# EAGLE design mmc (EAGLE 5.03)
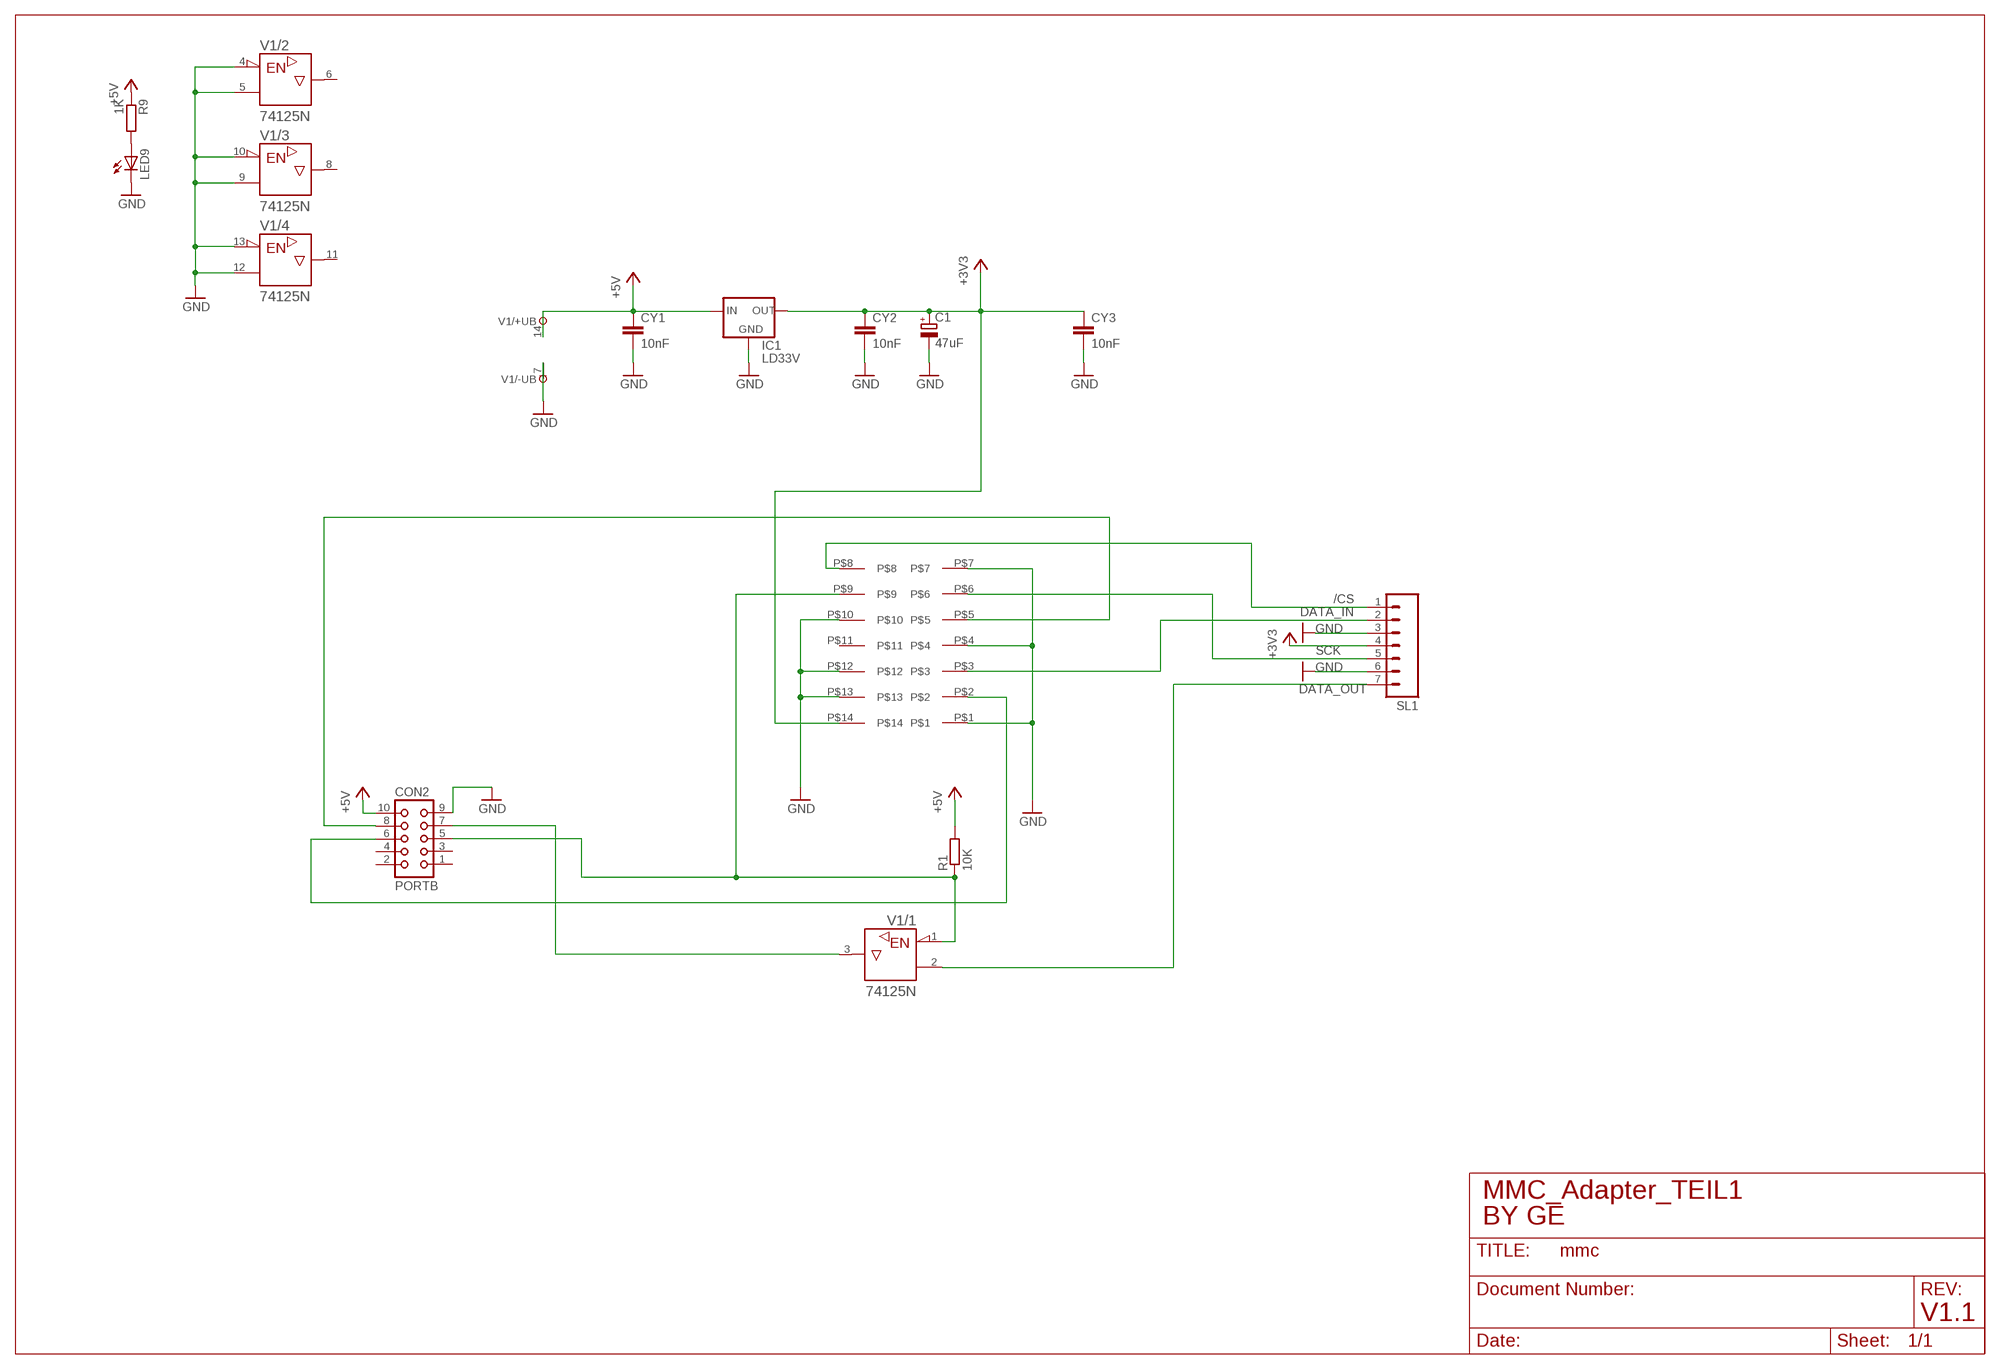
[diagram p0: schematic, sheet 1]

## Parts
C1  47uF  CPOL-EUTT5D7  [TT5D7]
CON2  PORTB  CON10  [CON10]
CY1  10nF  CYYC7B5  [YC7B5]
CY2  10nF  CYYC7B5  [YC7B5]
CY3  10nF  CYYC7B5  [YC7B5]
IC1  LD33V  [LD33V]
LED9  LED3MM  [LED3MM]
R1  10K  R-EU_0309/12  [0309/12]
R9  1K  R-EU_0204/2V  [0204V]
SL1  M07  [07P]
U$2  SO14_DILARGE14  [SO14_DILARGE14]
V1  74125N  [DIL14]

## Nets
+3V3: C1.+ CY2.1 CY3.1 IC1.OUT SL1.4 U$2.P$14
+5V: CON2.10 CY1.1 IC1.IN R1.2 R9.1 V1.14(/+UB:+UB)
/CS: SL1.1 U$2.P$8
DATA_IN: SL1.2 U$2.P$3
DATA_OUT: SL1.7 V1.2(/1:A)
GND: C1.- CON2.9 CY1.2 CY2.2 CY3.2 IC1.GND LED9.K(C) SL1.3 SL1.6 U$2.P$1 U$2.P$4 U$2.P$7 U$2.P$10 U$2.P$12 U$2.P$13 V1.4(/2:!G) V1.5(/2:A) V1.7(/-UB:-UB) V1.9(/3:A) V1.10(/3:!G) V1.12(/4:A) V1.13(/4:!G)
N$1: CON2.7 V1.3(/1:Y)
N$17: LED9.A R9.2
PB4_/CS: CON2.5 R1.1 U$2.P$9 V1.1(/1:!G)
PB5_MOSI: CON2.6 U$2.P$2
PB7_SCK: CON2.8 U$2.P$5
SCK: SL1.5 U$2.P$6
Unconnected: CON2.1 CON2.2 CON2.3 CON2.4 U$2.P$11 V1.6(/2:Y) V1.8(/3:Y) V1.11(/4:Y)

## Notes on the sheet
- MMC_Adapter_TEIL1
- BY GE
- V1.1

## Library data of the parts
C1 = rcl:CPOL-EU: POLARIZED CAPACITOR, European symbol
CON2 = con-harting:CON10: CONNECTOR
CY1-CY3 = rcl:CY: Y CAPACITOR for power line
IC1 = ge01:LD33V: VOLTAGE REGULATOR
LED9 = led:LED: LED OSRAM: - CHIPLED LG R971, LG N971, LY N971, LG Q971, LY Q971, LO R971, LY R971 LH N974, LH R974 LS Q976, LO Q976, LY Q976 LO Q996 - Hyper CHIPLED LW Q18S LB Q993, LB Q99A, LB R99A - SideLED LS A670, LO A670, LY A670, LG A670, LP A670 LB A673, LV A673, LT A673, LW A673 LH A674 LY A675 LS A676, LA A676, LO A676, LY A676, LW A676 LS A679, LY A679, LG A679 - Hyper Micro SIDELED® LS Y876, LA Y876, LO Y876, LY Y876 LT Y87S - SmartLED LW L88C, LW L88S LB L89C, LB L89S, LG L890 LS L89K, LO L89K, LY L89K LS L896, LA L896, LO L896, LY L896 - TOPLED LS T670, LO T670, LY T670, LG T670, LP T670 LSG T670, LSP T670, LSY T670, LOP T670, LYG T670 LG T671, LOG T671, LSG T671 LB T673, LV T673, LT T673, LW T673 LH T674 LS T676, LA T676, LO T676, LY T676, LB T676, LH T676, LSB T676, LW T676 LB T67C, LV T67C, LT T67C, LS T67K, LO T67K, LY T67K, LW E67C LS E67B, LA E67B, LO E67B, LY E67B, LB E67C, LV E67C, LT E67C LW T67C LS T679, LY T679, LG T679 LS T770, LO T770, LY T770, LG T770, LP T770 LB T773, LV T773, LT T773, LW T773 LH T774 LS E675, LA E675, LY E675, LS T675 LS T776, LA T776, LO T776, LY T776, LB T776 LHGB T686 LT T68C, LB T68C - Hyper Mini TOPLED® LB M676 - Mini TOPLED Santana® LG M470 LS M47K, LO M47K, LY M47K Source: http://www.osram.convergy.de LUXEON: - LUMILED® LXK2-PW12-R00, LXK2-PW12-S00, LXK2-PW14-U00, LXK2-PW14-V00 LXK2-PM12-R00, LXK2-PM12-S00, LXK2-PM14-U00 LXK2-PE12-Q00, LXK2-PE12-R00, LXK2-PE12-S00, LXK2-PE14-T00, LXK2-PE14-U00 LXK2-PB12-K00, LXK2-PB12-L00, LXK2-PB12-M00, LXK2-PB14-N00, LXK2-PB14-P00, LXK2-PB14-Q00 LXK2-PR12-L00, LXK2-PR12-M00, LXK2-PR14-Q00, LXK2-PR14-R00 LXK2-PD12-Q00, LXK2-PD12-R00, LXK2-PD12-S00 LXK2-PH12-R00, LXK2-PH12-S00 LXK2-PL12-P00, LXK2-PL12-Q00, LXK2-PL12-R00 Source: www.luxeon.com KINGBRIGHT: KA-3528ASYC Source: www.kingbright.com
R1 R9 = rcl:R-EU_: RESISTOR, European symbol
SL1 = con-amp-quick:M07: AMP QUICK CONNECTOR
U$2 = ge01:SO14_DILARGE14
V1 = 74ttl-din:74*125: Quad bus BUFFER, 3-state

## Board
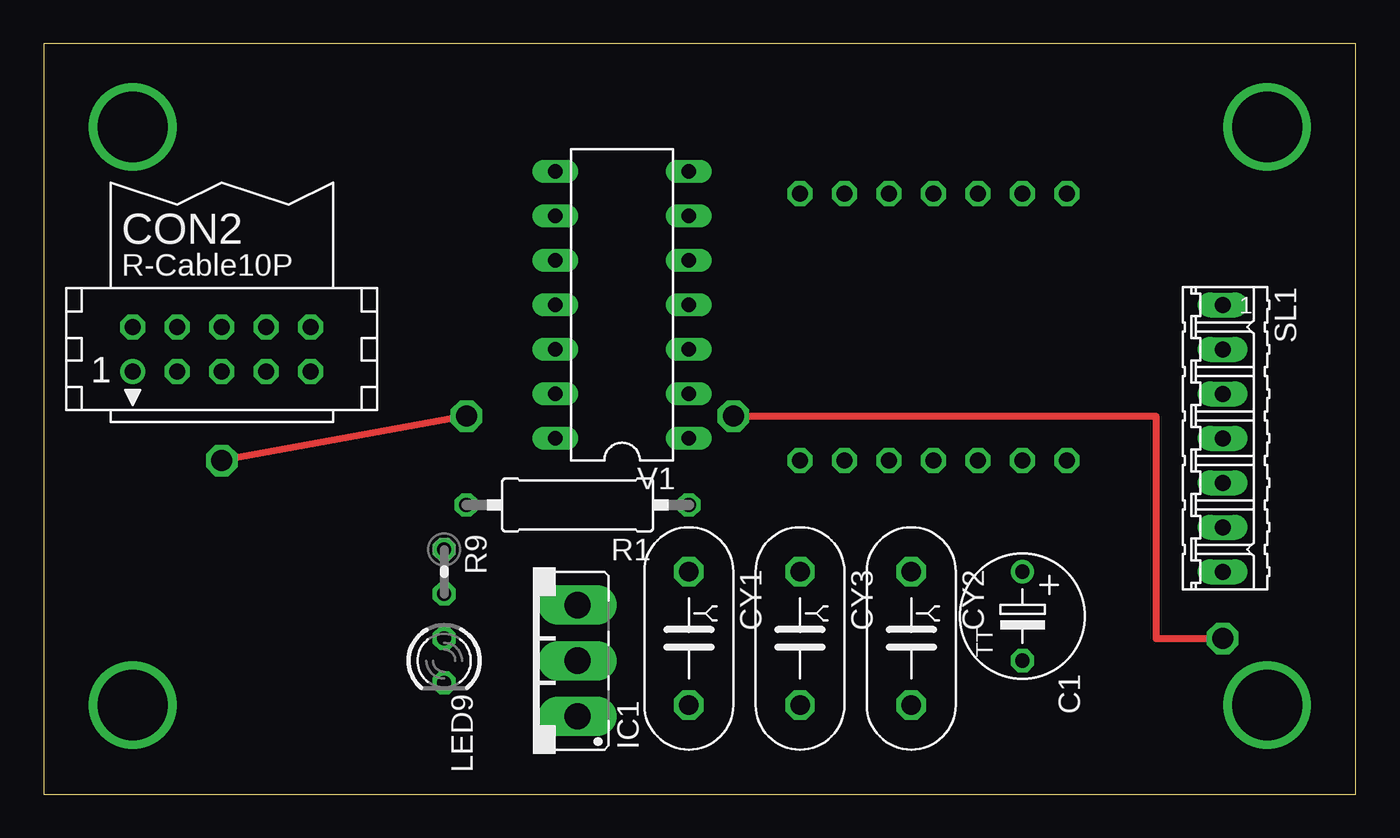
[diagram p1: board, top side]
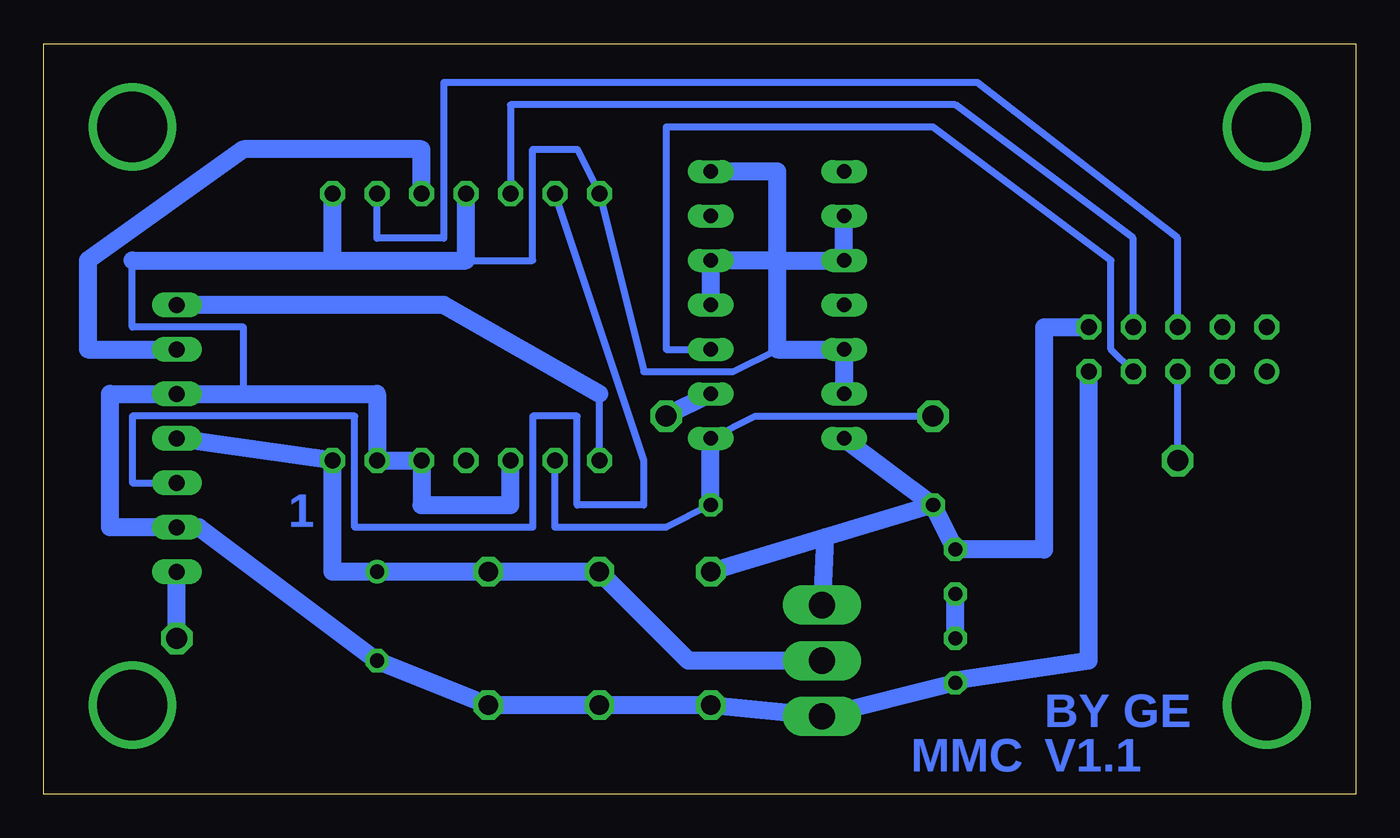
[diagram p2: board, bottom side, seen from below]

Size 74.91 x 42.85 mm. Coordinates in mm from the lower left corner, seen from the top.
Outline: 0,0 74.91,0 74.91,42.85 0,42.85 0,0
Copper layers (1*16): Top 0.035mm / dielectric 1.5mm / Bottom 0.035mm
Design rules "0.35mm *": minimum track width 10mil, minimum drill 24mil, track to track 0.35mm, track to pad 0.35mm, pad to pad 0.35mm, via to via 0.35mm, smd to smd 0.35mm, copper to edge 40mil, drill to drill 8mil, minimum pad ring 10mil, minimum via ring 8mil, stop-mask expansion 4mil, vias tented up to drill 0mil, thermal gap 10mil

### Footprints (pad centres in the part's own frame; a part is rotated, then mirrored left to right if it is on the bottom)
TT5D7 = drill 0.813 round: + -2.54,0 | drill 0.813 octagon: - 2.54,0
CON10 = drill 0.914 round: 1 -5.08,-1.27 | drill 0.914 octagon: 2 -5.08,1.27; 3 -2.54,-1.27; 4 -2.54,1.27; 5 0,-1.27; 6 0,1.27; 7 2.54,-1.27; 8 2.54,1.27; 9 5.08,-1.27; 10 5.08,1.27
YC7B5 = drill 1.118 octagon: 1 -3.81,0; 2 3.81,0
LD33V = drill 1.499 long: GND -3.175,-2.54; IN 3.175,-2.54; OUT 0,-2.54
LED3MM = drill 0.813 octagon: A -1.27,0; K 1.27,0
0309/12 = drill 0.813 octagon: 1 -6.35,0; 2 6.35,0
0204V = drill 0.813 octagon: 1 -1.27,0; 2 1.27,0
07P = drill 0.914 long: 1 -7.62,0; 2 -5.08,0; 3 -2.54,0; 4 0,0; 5 2.54,0; 6 5.08,0; 7 7.62,0
SO14_DILARGE14 = drill 0.914 octagon: P$1 0,0; P$2 2.54,0; P$3 5.08,0; P$4 7.62,0; P$5 10.16,0; P$6 12.7,0; P$7 15.24,0; P$8 15.24,15.24; P$9 12.7,15.24; P$10 10.16,15.24; P$11 7.62,15.24; P$12 5.08,15.24; P$13 2.54,15.24; P$14 0,15.24
DIL14 = drill 0.813 long: 1 -7.62,-3.81; 2 -5.08,-3.81; 3 -2.54,-3.81; 4 0,-3.81; 5 2.54,-3.81; 6 5.08,-3.81; 7 7.62,-3.81; 8 7.62,3.81; 9 5.08,3.81; 10 2.54,3.81; 11 0,3.81; 12 -2.54,3.81; 13 -5.08,3.81; 14 -7.62,3.81

### Placement (x,y rotation side)
C1  55.88,10.16 270 top
CON2  10.16,25.4 0 top
CY1  36.83,8.89 270 top
CY2  49.53,8.89 270 top
CY3  43.18,8.89 270 top
IC1  27.94,7.62 90 top
LED9  22.86,7.62 270 top
R1  30.48,16.51 180 top
R9  22.86,12.7 270 top
SL1  67.31,20.32 270 top
U$2  58.42,34.29 180 top
V1  33.02,27.94 90 top

### Tracks (layer width: path | path; a pad name or v marks a point on that pad's centre or on a via)
+3V3
  Bottom 1.016: SL1.4 U$2.P$14 58.42,12.7 C1.+ CY2.1 CY3.1 38.1,7.62 IC1.OUT
+5V
  Bottom 1.016: CON2.10 17.78,26.67 17.78,13.97 R9.1 R1.2 | R1.2 V1.14 | R1.2 30.3,14.66 | 30.3,14.66 CY1.1 | 30.3,14.66 IC1.IN
/CS
  Bottom 0.406: U$2.P$8 43.18,22.86
  Bottom 1.016: 43.18,22.86 52.07,27.94 SL1.1
DATA_IN
  Bottom 1.016: SL1.2 72.39,25.4 72.39,30.48 63.5,36.83 53.34,36.83 U$2.P$3
DATA_OUT  (via drill 1.2)
  Top 0.406: v39.37,21.59 63.5,21.59 63.5,8.89 v67.31,8.89
  Bottom 1.016: V1.2 v39.37,21.59 | v67.31,8.89 SL1.7
GND
  Bottom 0.254: 66.04,15.24 SL1.6
  Bottom 0.406: 50.8,30.48 46.99,30.48 46.99,36.83 44.45,36.83 U$2.P$7 40.64,24.13 35.56,24.13 33.02,25.4 33.02,35.56 | 69.85,30.48 69.85,26.67 63.5,26.67 63.5,22.86
  Bottom 1.016: CON2.9 15.24,7.62 22.76,6.5 LED9.K IC1.GND CY1.2 CY3.2 CY2.2 C1.- 66.04,15.24 | V1.4 V1.5 33.02,30.48 | V1.9 V1.10 33.02,30.48 | 33.02,30.48 33.02,35.56 V1.7 | 33.02,30.48 33.02,25.4 V1.12 V1.13 | U$2.P$4 50.8,30.48 58.42,30.48 | 58.42,30.48 U$2.P$1 | SL1.6 71.12,15.24 71.12,22.86 SL1.3 63.5,22.86 55.88,22.86 U$2.P$13 U$2.P$12 53.34,16.51 48.26,16.51 U$2.P$10 | 69.85,30.48 58.42,30.48
N$1
  Bottom 0.406: V1.3 39.37,25.4 39.37,38.1 24.13,38.1 13.97,30.48 13.97,25.4 CON2.7
N$2  (via drill 4)
  other vias: 5.08,5.08
N$17
  Bottom 1.016: LED9.A R9.2
N$18  (via drill 4)
  other vias: 69.85,5.08
N$19  (via drill 4)
  other vias: 5.08,38.1
N$20  (via drill 4)
  other vias: 69.85,38.1
PB4_/CS  (via drill 1.2)
  Top 0.406: v24.13,21.59 v10.16,19.05
  Bottom 0.406: U$2.P$9 45.72,15.24 39.37,15.24 R1.1 V1.1 34.29,21.59 v24.13,21.59 | v10.16,19.05 CON2.5
  Bottom 1.016: R1.1 V1.1
PB5_MOSI
  Bottom 0.406: U$2.P$2 55.88,31.75 52.07,31.75 52.07,40.64 21.59,40.64 10.16,31.75 CON2.6
PB7_SCK
  Bottom 0.406: U$2.P$5 48.26,39.37 22.86,39.37 12.7,31.75 CON2.8
SCK
  Bottom 0.406: U$2.P$6 40.64,19.05 40.64,16.51 44.45,16.51 44.45,21.59 46.99,21.59 46.99,15.24 57.15,15.24 57.15,21.59 69.85,21.59 69.85,17.78 SL1.5

### Text on the board
Bottom: 1 | BY GE | V1.1 | MMC